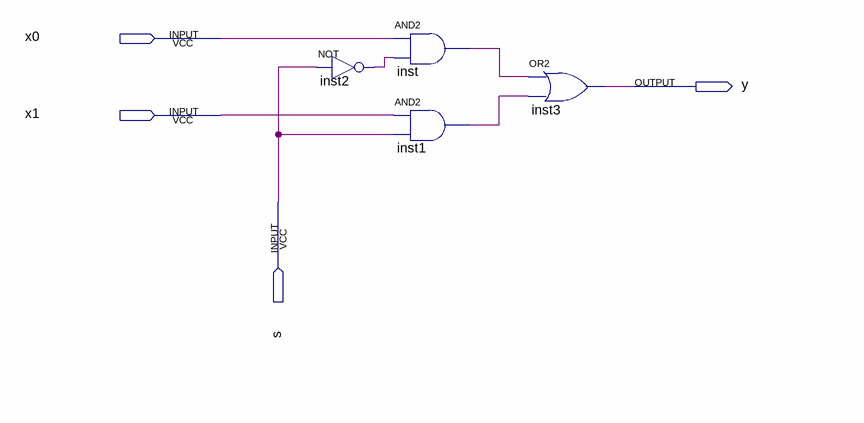
[diagram p0: schematic sheet]
// Quartus schematic MX2.bdf as structural Verilog: 4 symbols, 4 pins
module MX2 (
  input  x0,
  input  x1,
  input  s,
  output y
);

  wire inst1_out, inst2_out, inst_out;

  not inst2 (inst2_out, s);
  and inst (inst_out, x0, inst2_out);
  and inst1 (inst1_out, x1, s);
  or inst3 (y, inst_out, inst1_out);
endmodule
